# Altium schematic sheet MotorDrive.SchDoc
size A4
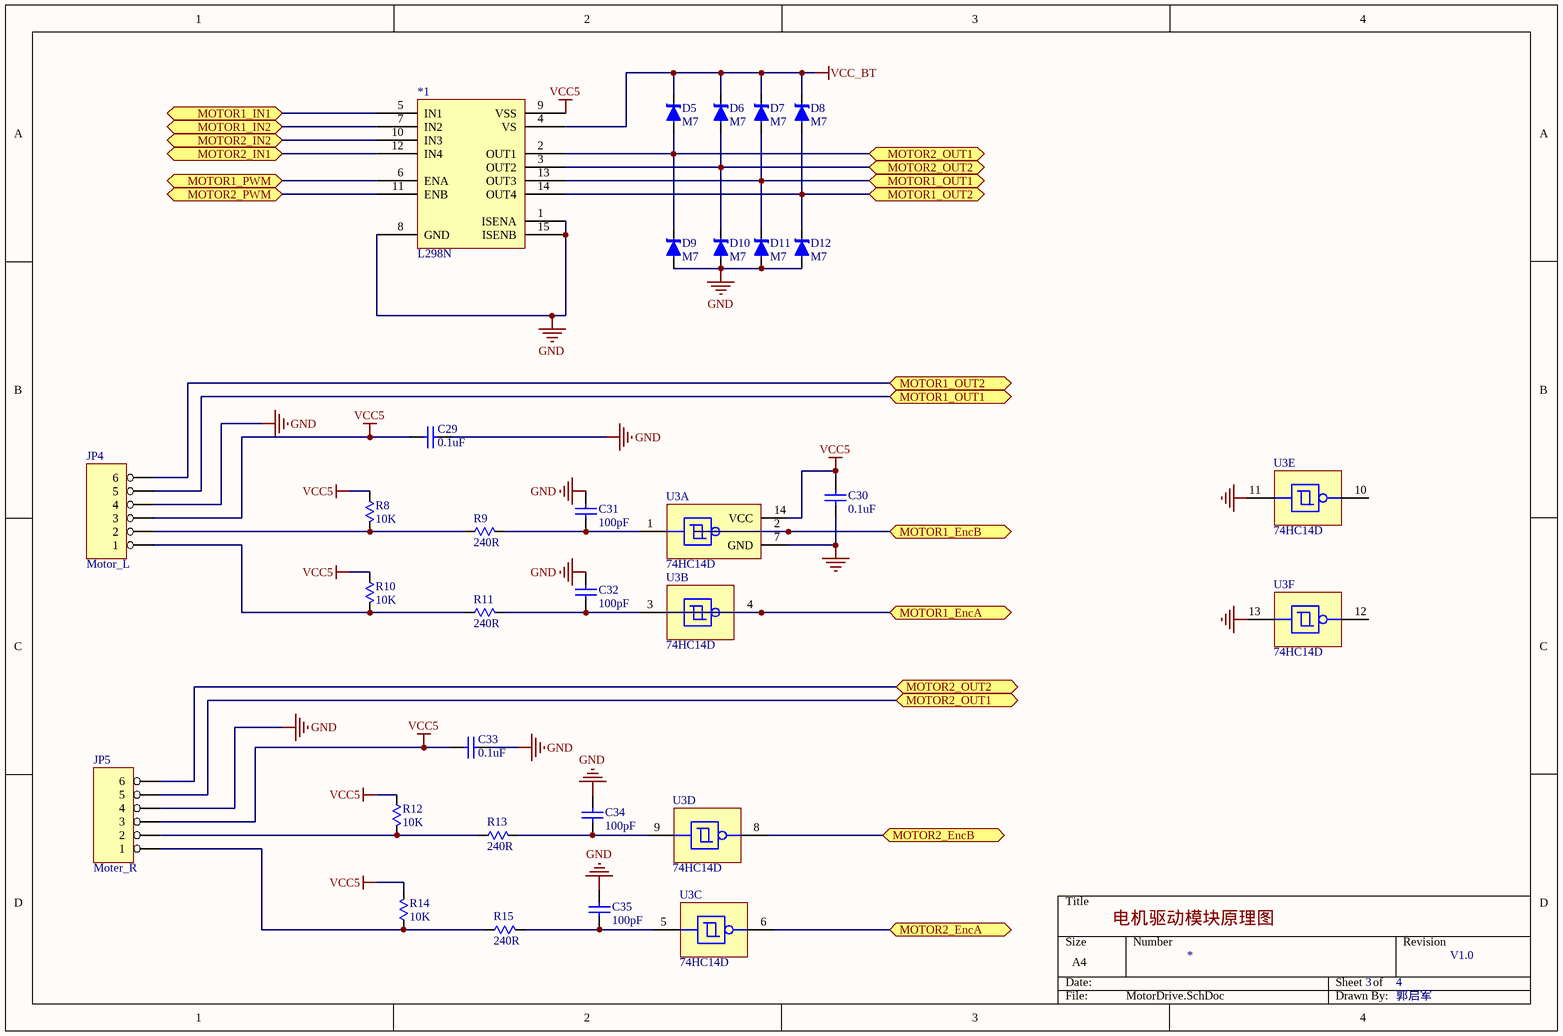
[diagram p0: MotorDrive.SchDoc]

## Parts
*1  L298N  [L298N散热片]
C29  0.1uF  [0805-bottom layer]
C30  0.1uF  [0805-bottom layer]
C31  100pF  [0805-bottom layer]
C32  100pF  [0805-bottom layer]
C33  0.1uF  [0805-bottom layer]
C34  100pF  [0805-bottom layer]
C35  100pF  [0805-bottom layer]
D5  M7  [SMB]
D6  M7  [SMB]
D7  M7  [SMB]
D8  M7  [SMB]
D9  M7  [SMB]
D10  M7  [SMB]
D11  M7  [SMB]
D12  M7  [SMB]
JP4  Motor_L  [HDR1X6]
JP5  Moter_R  [HDR1X6]
R8  10K  [0805-bottom layer]
R9  240R  [0805-bottom layer]
R10  10K  [0805-bottom layer]
R11  240R  [0805-bottom layer]
R12  10K  [0805-bottom layer]
R13  240R  [0805-bottom layer]
R14  10K  [0805-bottom layer]
R15  240R  [0805-bottom layer]
U3  74HC14D  [SO14-150]  (parts A,B,C,D,E,F of 6)

## Ports
MOTOR1_EncA, MOTOR1_EncB, MOTOR1_IN1, MOTOR1_IN2, MOTOR1_OUT1, MOTOR1_OUT2, MOTOR1_PWM, MOTOR2_EncA, MOTOR2_EncB, MOTOR2_IN1, MOTOR2_IN2, MOTOR2_OUT1, MOTOR2_OUT2, MOTOR2_PWM

## Nets
GND: *1.1(ISENA) *1.8(GND) *1.15(ISENB) C29.2 C30.2 C31.1 C32.1 C33.2 C34.1 C35.2 D9.1(A) D10.1(A) D11.1(A) D12.1(A) JP4.4 JP5.4 U3.7(GND) U3.11(A) U3.13(A)
VCC5: *1.9(VSS) C29.1 C30.1 C33.1 JP4.3 JP5.3 R8.2 R10.2 R12.2 R14.1 U3.14(VCC)
VCC_BT: *1.4(VS) D5.2(K) D6.2(K) D7.2(K) D8.2(K)
MOTOR1_EncA: U3.4(Y) ; port MOTOR1_EncA
MOTOR1_EncB: U3.2(Y) ; port MOTOR1_EncB
MOTOR1_IN1: *1.5(IN1) ; port MOTOR1_IN1
MOTOR1_IN2: *1.7(IN2) ; port MOTOR1_IN2
MOTOR1_OUT1: *1.13(OUT3) D7.1(A) D11.2(K) JP4.5 ; port MOTOR1_OUT1
MOTOR1_OUT2: *1.14(OUT4) D8.1(A) D12.2(K) JP4.6 ; port MOTOR1_OUT2
MOTOR1_PWM: *1.6(ENA) ; port MOTOR1_PWM
MOTOR2_EncA: U3.6(Y) ; port MOTOR2_EncA
MOTOR2_EncB: U3.8(Y) ; port MOTOR2_EncB
MOTOR2_IN1: *1.12(IN4) ; port MOTOR2_IN1
MOTOR2_IN2: *1.10(IN3) ; port MOTOR2_IN2
MOTOR2_OUT1: *1.2(OUT1) D5.1(A) D9.2(K) JP5.5 ; port MOTOR2_OUT1
MOTOR2_OUT2: *1.3(OUT2) D6.1(A) D10.2(K) JP5.6 ; port MOTOR2_OUT2
MOTOR2_PWM: *1.11(ENB) ; port MOTOR2_PWM
NetC31_2: C31.2 R9.1 U3.1(A)
NetC32_2: C32.2 R11.1 U3.3(A)
NetC34_2: C34.2 R13.1 U3.9(A)
NetC35_1: C35.1 R15.1 U3.5(A)
NetJP4_1: JP4.1 R10.1 R11.2
NetJP4_2: JP4.2 R8.1 R9.2
NetJP5_1: JP5.1 R14.2 R15.2
NetJP5_2: JP5.2 R12.1 R13.2

Not connected (* = marked no-connect by the designer): U3 10(Y) 12(Y)

## Notes on the sheet
- 电机驱动模块原理图
- *
- 3
- 4
- V1.0
- 郭启军

## Library data of the parts
C29-C35 = CAP: Capacitor
D5-D12 = DIODE-SBD: Schottky barrier rectifier
JP4 JP5 = HEADER 6
R8-R15 = RES: Resistor
U3 = 74HC14D: Hex inverting Schmitt trigger